# Altium schematic sheet CH32V305GBU6-R0.SchDoc
size 304 x 228 mm; SheetNumber: 0; SheetTotal: 0
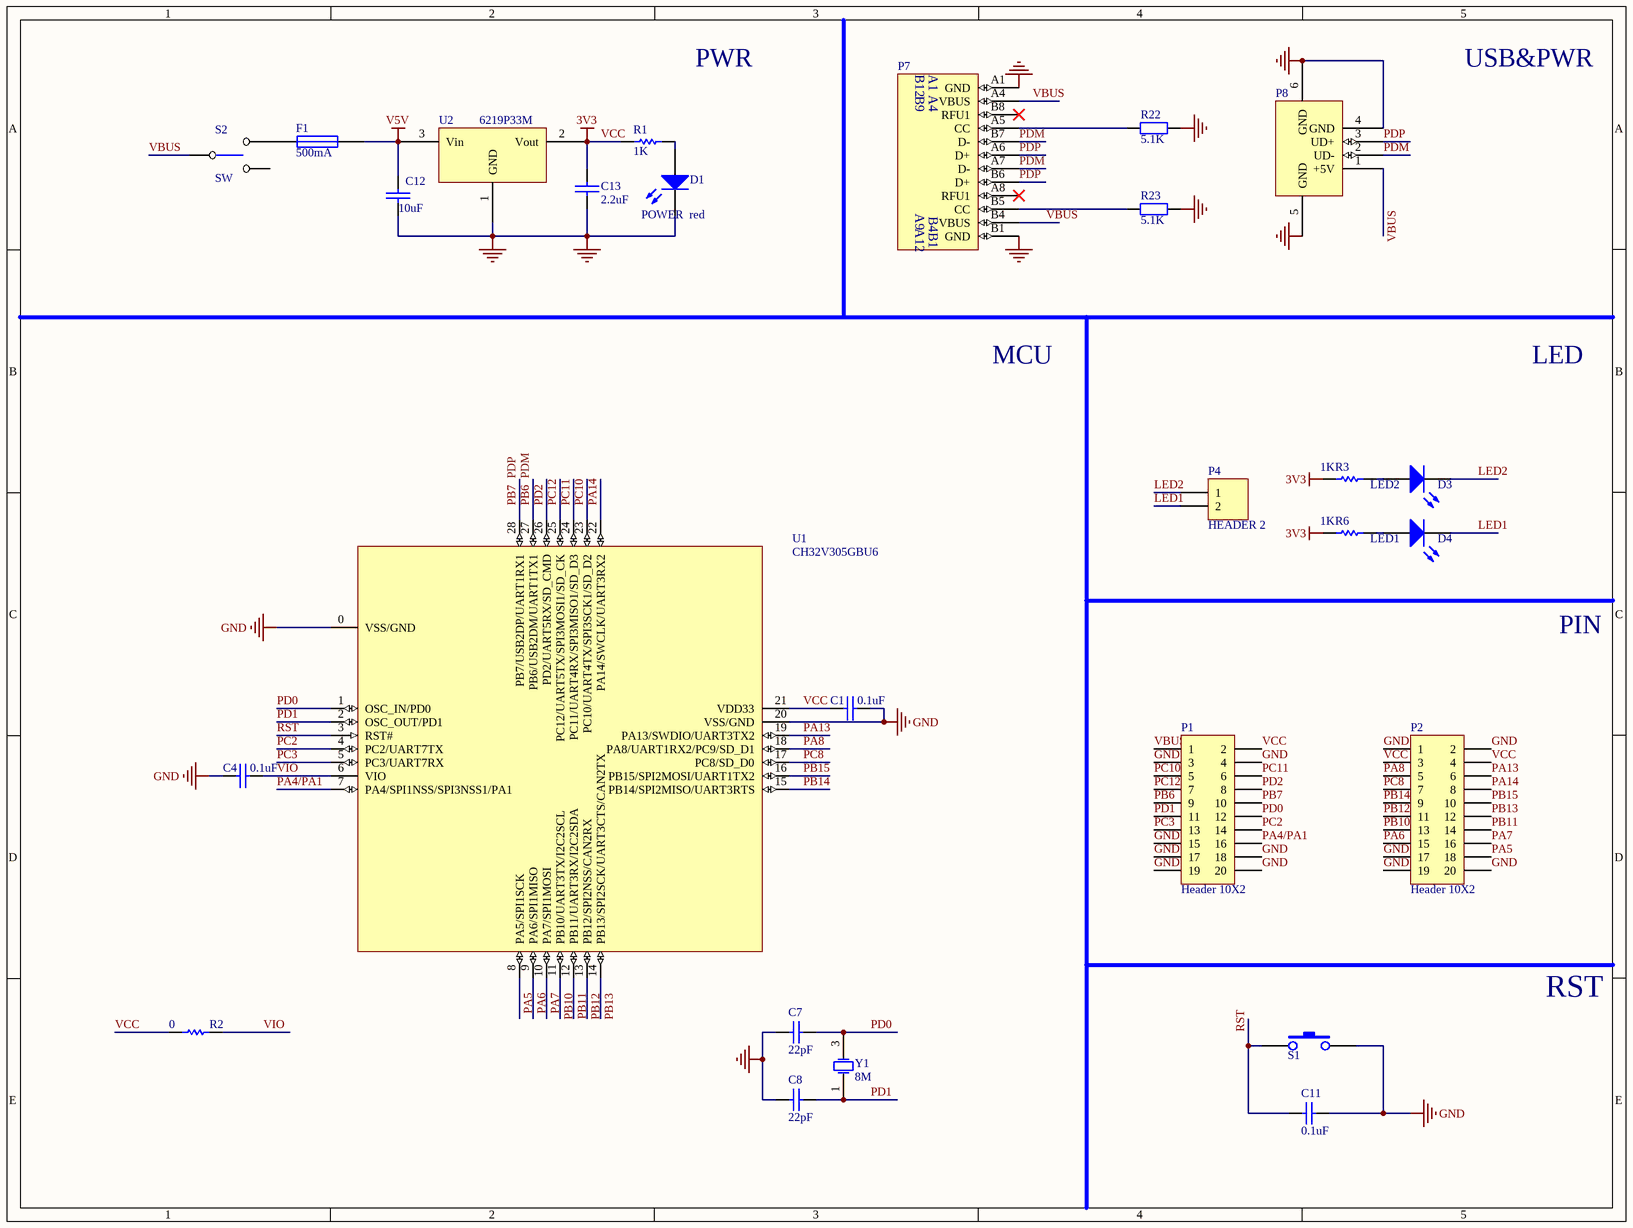
[diagram p0: CH32V305GBU6-R0.SchDoc]

## Parts
C1  0.1uF  [0603_C]
C4  0.1uF  [0603_C]
C7  22pF  [0603_C]
C8  22pF  [0603_C]
C11  0.1uF  [0603_C]
C12  10uF  [0603_C]
C13  2.2uF  [0603_C]
D1  POWER  red  [0603+]
D3  LED2  [0603+]
D4  LED1  [0603+]
F1  500mA  [0603]
P1  Header 10X2  [IDC20-2.54mm]
P2  Header 10X2  [IDC20-2.54mm]
P4  HEADER 2  [SIP2-2.54mm]
P7  TYPE-C  [TYPE-C-Receptacle-2.0]  (value not drawn)
P8  USB_A  [USBAF]  (value not drawn)
R1  1K  [0603]
R2  0  [0603]
R3  1K  [0603]
R6  1K  [0603]
R22  5.1K  [0603]
R23  5.1K  [0603]
S1  RST  [SMD_6.1x3.65x2.5mm-KEY]  (value not drawn)
S2  SW  [SW1]
U1  CH32V305GBU6  [QFN28_4X4]
U2  6219P33M  [SOT-23]
Y1  8M  [XT3225]

## Nets
GND: C1.2 C4.2 C7.1 C8.1 C11.1 C12.2 C13.2 D1.2(K) P1.3 P1.4 P1.15 P1.17 P1.18 P1.19 P1.20 P2.1 P2.2 P2.17 P2.19 P2.20 P7.A1(GND) P7.B1(GND) P8.4(GND) P8.5(GND) P8.6(GND) R22.2 R23.2 S1.2 U1.0(VSS/GND) U1.20(VSS/GND) U2.1(GND)
V5V: C12.1 F1.2 U2.3(Vin)
VCC: C1.1 C13.1 P1.2 P2.3 P2.4 R1.2 R2.1 R3.1 R6.1 U1.21(VDD33) U2.2(Vout)  [also labelled 3V3]
LED1: D4.2(K) P4.2
LED2: D3.2(K) P4.1
PA4/PA1: P1.16 U1.7(PA4/SPI1NSS/SPI3NSS1/PA1)
PA5: P2.18 U1.8(PA5/SPI1SCK)
PA6: P2.15 U1.9(PA6/SPI1MISO)
PA7: P2.16 U1.10(PA7/SPI1MOSI)
PA8: P2.5 U1.18(PA8/UART1RX2/PC9/SD_D1)
PA13: P2.6 U1.19(PA13/SWDIO/UART3TX2)
PA14: P2.8 U1.22(PA14/SWCLK/UART3RX2)
PB6: P1.9 P7.A7(D-) P7.B7(D-) P8.2(UD-) U1.27(PB6/USB2DM/UART1TX1)  [also labelled PDM]
PB7: P1.10 P7.A6(D+) P7.B6(D+) P8.3(UD+) U1.28(PB7/USB2DP/UART1RX1)  [also labelled PDP]
PB10: P2.13 U1.11(PB10/UART3TX/I2C2SCL)
PB11: P2.14 U1.12(PB11/UART3RX/I2C2SDA)
PB12: P2.11 U1.13(PB12/SPI2NSS/CAN2RX)
PB13: P2.12 U1.14(PB13/SPI2SCK/UART3CTS/CAN2TX)
PB14: P2.9 U1.15(PB14/SPI2MISO/UART3RTS)
PB15: P2.10 U1.16(PB15/SPI2MOSI/UART1TX2)
PC2: P1.14 U1.4(PC2/UART7TX)
PC3: P1.13 U1.5(PC3/UART7RX)
PC8: P2.7 U1.17(PC8/SD_D0)
PC10: P1.5 U1.23(PC10/UART4TX/SPI3SCK1/SD_D2)
PC11: P1.6 U1.24(PC11/UART4RX/SPI3MISO1/SD_D3)
PC12: P1.7 U1.25(PC12/UART5TX/SPI3MOSI1/SD_CK)
PD0: C7.2 P1.12 U1.1(OSC_IN/PD0) Y1.3(OSC2)
PD1: C8.2 P1.11 U1.2(OSC_OUT/PD1) Y1.1(OSC1)
PD2: P1.8 U1.26(PD2/UART5RX/SD_CMD)
RST: C11.2 S1.1 U1.3(RST#)
VBUS: P1.1 P7.A4(VBUS) P7.B4(VBUS) P8.1(+5V) S2.1
VIO: C4.1 R2.2 U1.6(VIO)
NetD1_1: D1.1(A) R1.1
NetD3_1: D3.1(A) R3.2
NetD4_1: D4.1(A) R6.2
NetF1_1: F1.1 S2.3
NetP7_A5: P7.A5(CC) R22.1
NetP7_B5: P7.B5(CC) R23.1

Not connected (* = marked no-connect by the designer): P7 A8(RFU1)* B8(RFU1)*; S2 2

## Notes on the sheet
- PWR
- USB&PWR
- MCU
- LED
- PIN
- RST
- Title
- Size:
- Date:
- A3
- Number:
- Time:
- Revision:
- Sheet
- of
- File:
- (in symbol TYPE-C1) B12; B9; A9; A12

## Library data of the parts
C1 C4 C12 C13 = CAP: Capacitor
C7 C8 C11 = Cap: Capacitor
  C7 C8: Published: 8-Jun-2000; LatestRevisionDate: 17-Jul-2002; LatestRevisionNote: Re-released for DXP Platform.; PackageReference: RAD-0.3; Publisher: Altium Limited
D1 D3 D4 = LED0: Typical INFRARED GaAs LED; Published: 8-Jun-2000; LatestRevisionDate: 08-Jul-2005; LatestRevisionNote: Mech Layer 1 removed.; PackageReference: LED-0; Publisher: Altium Limited
F1 = FUSE1: Fuse
P1 P2 = Header 10X2: Header, 10-Pin, Dual row; LatestRevisionDate: 17-Jul-2002; LatestRevisionNote: Re-released for DXP Platform.; Publisher: Altium Limited
P4 = HEADER 2: Header, 2-Pin
P7 = TYPE-C1
P8 = USB: USB Port
R1-R3 R6 = Res Semi: Semiconductor Resistor
  R1: Published: 8-Jun-2000; LatestRevisionDate: 17-Jul-2002; LatestRevisionNote: Re-released for DXP Platform.; PackageReference: AXIAL-0.5; Publisher: Altium Limited; Value: 1K
R22 R23 = Res2: Resistor
S1 = KEY
U1 = CH32V305GBU6: RISC-V MCU, 144MHz, USB_480M, CAN, UART*4, SPI*3, SDIO
Y1 = XTAL: Crystal Oscillator; Published: 8-Jun-2000; LatestRevisionDate: 17-Jul-2002; LatestRevisionNote: Re-released for DXP Platform.; PackageReference: R38; Publisher: Altium Limited